# Altium schematic sheet SPWM_PS_V1.00.SCHDOC
size A3
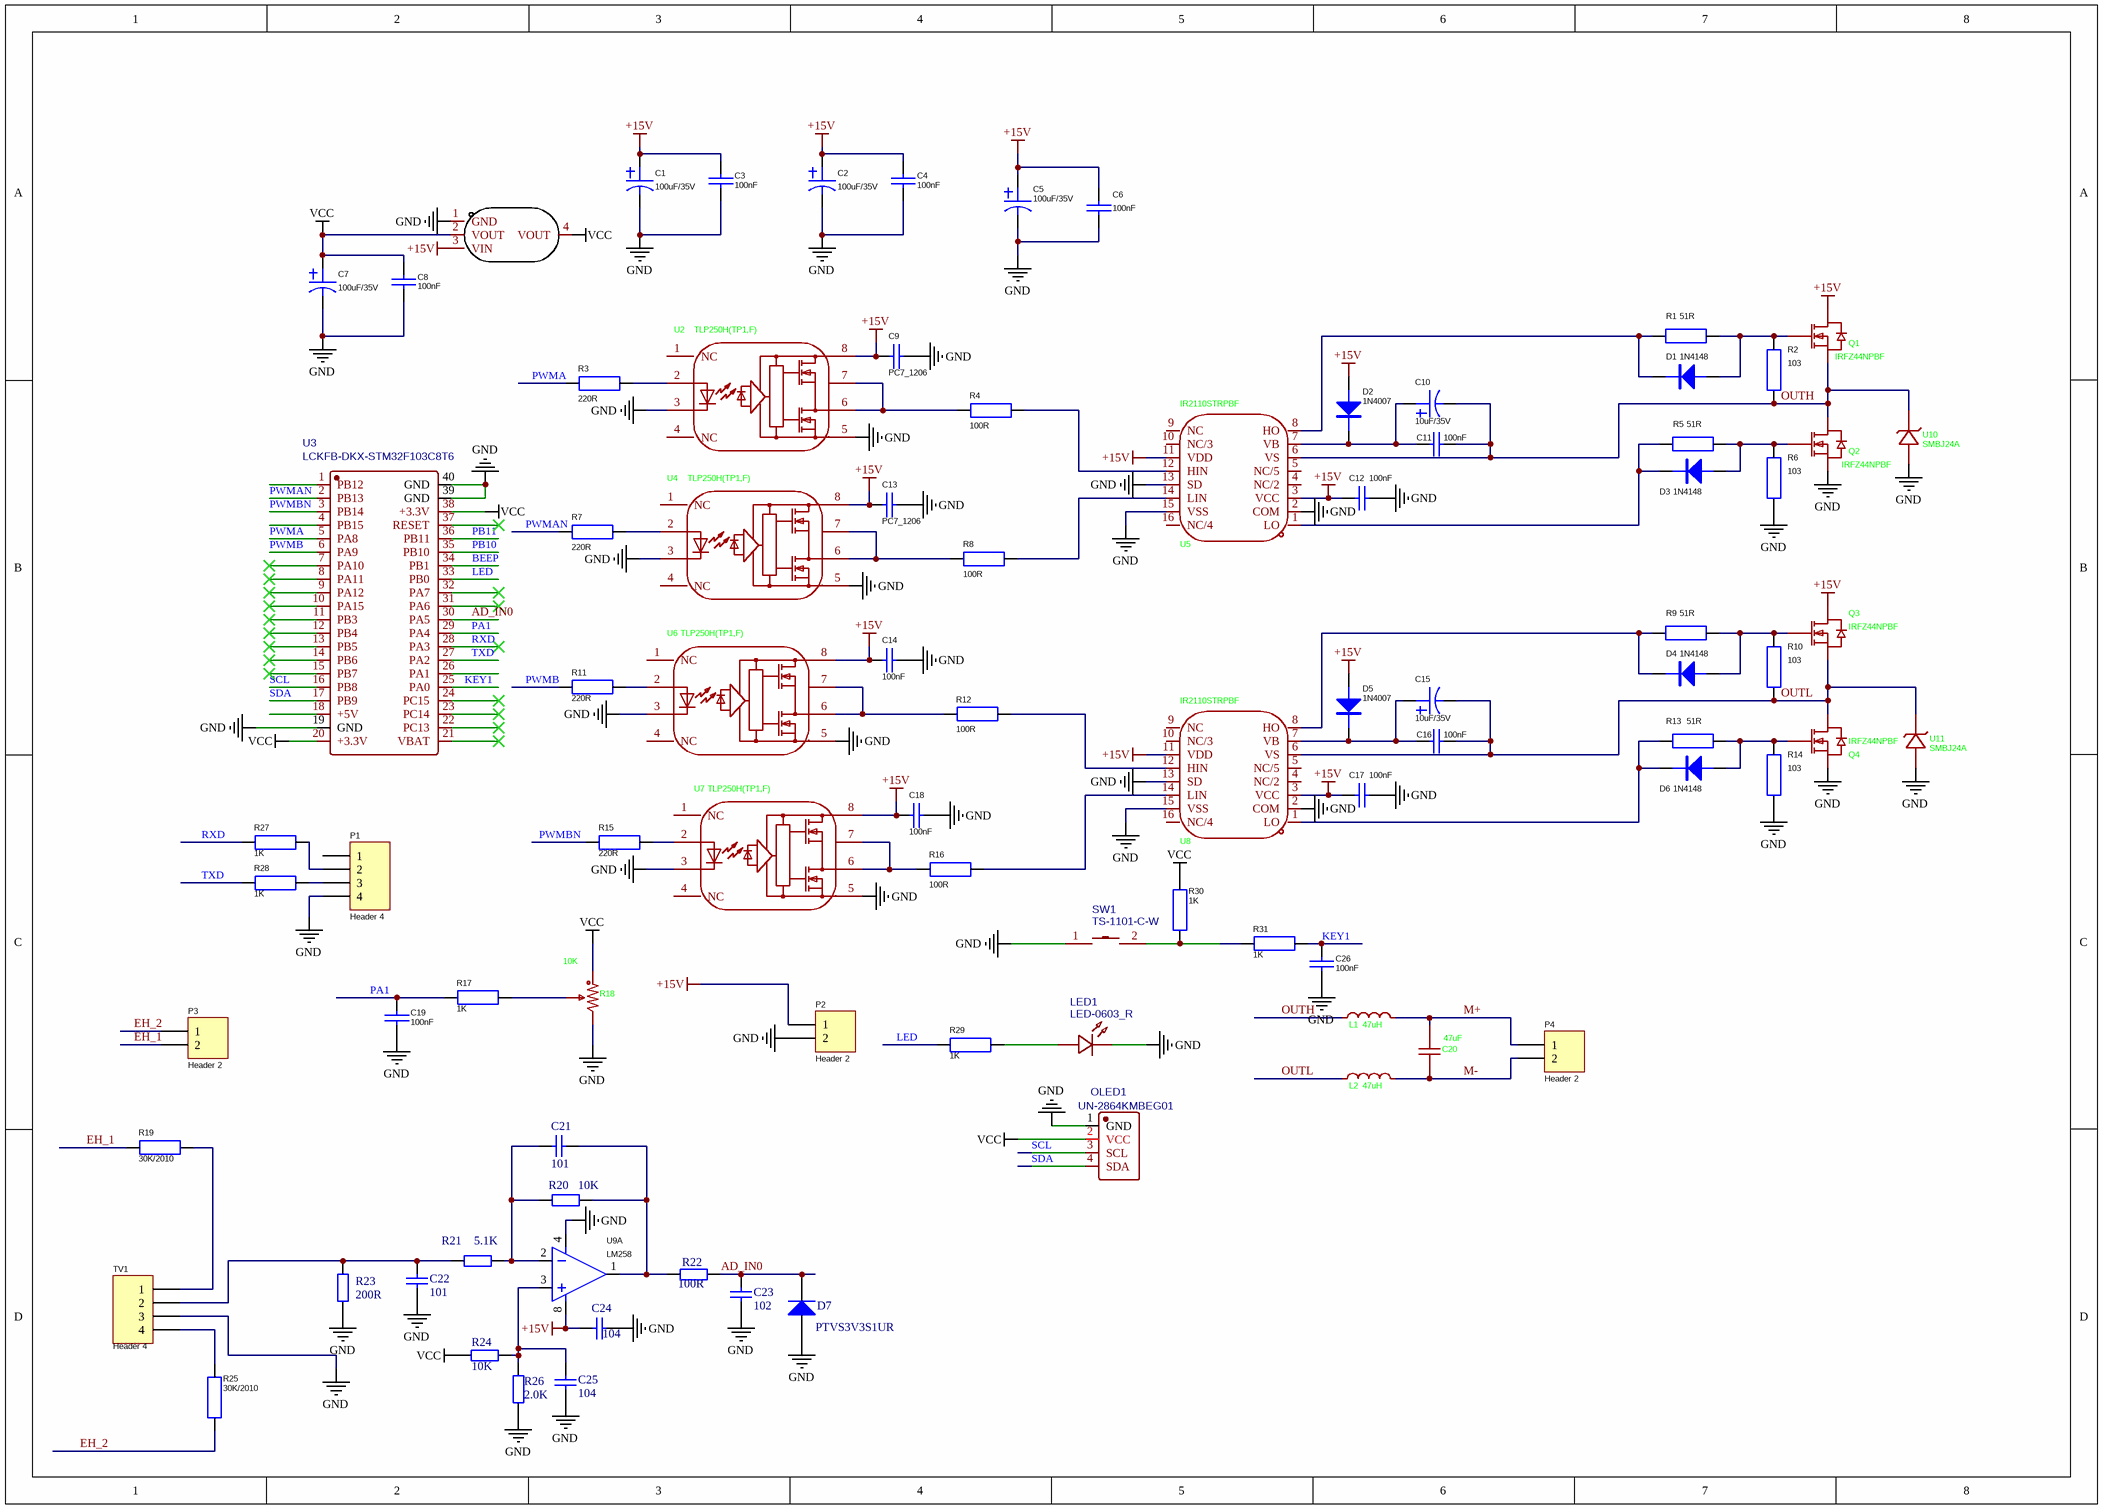
[diagram p0: SPWM_PS_V1.00.SCHDOC]

## Parts
C1  100uF/35V  [PCD-10135-MB-36_100UF/35V]
C2  100uF/35V  [PCD-10135-MB-36_100UF/35V]
C3  100nF  [PC7-*****-KN-0A_0805]
C4  100nF  [PC7-*****-KN-0A_0805]
C5  100uF/35V  [PCD-10135-MB-36_100UF/35V]
C6  100nF  [PC7-*****-KN-0A_0805]
C7  100uF/35V  [PCD-10135-MB-36_100UF/35V]
C8  100nF  [PC7-*****-KN-0A_0805]
C9  PC7_1206  [PC7-*****-KN-0A_0805]
C10  10uF/35V  [PCD-10050-MA-26_10UF/50V]
C11  100nF  [PC7-*****-KN-0A_0805]
C12  100nF  [PC7-*****-KN-0A_0805]
C13  PC7_1206  [PC7-*****-KN-0A_0805]
C14  100nF  [PC7-*****-KN-0A_0805]
C15  10uF/35V  [PCD-10050-MA-26_10UF/50V]
C16  100nF  [PC7-*****-KN-0A_0805]
C17  100nF  [PC7-*****-KN-0A_0805]
C18  100nF  [PC7-*****-KN-0A_0805]
C19  100nF  [PC7-*****-KN-0A_0805]
C20  47uF  [C2220]
C21  101  [PC7-*****-KN-0A_0805]
C22  101  [PC7-*****-KN-0A_0805]
C23  102  [PC7-*****-KN-0A_0805]
C24  104  [PC7-*****-KN-0A_0805]
C25  104  [PC7-*****-KN-0A_0805]
C26  100nF  [PC7-*****-KN-0A_0805]
D1  1N4148  [PDD-00020-30-2A_RLS4148NTE-11-K]
D2  1N4007  [PDD-00020-30-2A_RLS4148NTE-11-K]
D3  1N4148  [PDD-00020-30-2A_RLS4148NTE-11-K]
D4  1N4148  [PDD-00020-30-2A_RLS4148NTE-11-K]
D5  1N4007  [PDD-00020-30-2A_RLS4148NTE-11-K]
D6  1N4148  [PDD-00020-30-2A_RLS4148NTE-11-K]
D7  PTVS3V3S1UR  [SOD123]
L1  47uH  [IND-SMD_L13.8-W12.6_H6.5]
L2  47uH  [IND-SMD_L13.8-W12.6_H6.5]
LED1  LED-0603_R  [LED0603_RED]
OLED1  UN-2864KMBEG01  [OLED-TH_4P-P2.54-L27.8-W27.3]
P1  Header 4  [HDR1X4]
P2  Header 2  [CONN-TH_2P-P5.00_WJ128V-5.0-2P]
P3  Header 2  [CONN-TH_2P-P5.00_WJ128V-5.0-2P]
P4  Header 2  [CONN-TH_2P-P5.00_WJ128V-5.0-2P]
Q1  IRFZ44NPBF  [TO-220-3_L10.0-W4.5-P2.54-L]
Q2  IRFZ44NPBF  [TO-220-3_L10.0-W4.5-P2.54-L]
Q3  IRFZ44NPBF  [TO-220-3_L10.0-W4.5-P2.54-L]
Q4  IRFZ44NPBF  [TO-220-3_L10.0-W4.5-P2.54-L]
R1  51R  [PRC-*****-1M-0A_0805]
R2  103  [PRC-*****-1M-0A_0805]
R3  220R  [PRC-*****-1M-0A_0805]
R4  100R  [PRC-*****-1M-0A_0805]
R5  51R  [PRC-*****-1M-0A_0805]
R6  103  [PRC-*****-1M-0A_0805]
R7  220R  [PRC-*****-1M-0A_0805]
R8  100R  [PRC-*****-1M-0A_0805]
R9  51R  [PRC-*****-1M-0A_0805]
R10  103  [PRC-*****-1M-0A_0805]
R11  220R  [PRC-*****-1M-0A_0805]
R12  100R  [PRC-*****-1M-0A_0805]
R13  51R  [PRC-*****-1M-0A_0805]
R14  103  [PRC-*****-1M-0A_0805]
R15  220R  [PRC-*****-1M-0A_0805]
R16  100R  [PRC-*****-1M-0A_0805]
R17  1K  [PRC-*****-1M-0A_0805]
R18  10K  [RES-ADJ-TH_RK09Y11L0001]
R19  30K/2010  [PRC-*****-CM-0A_2010]
R20  10K  [PRM-*****-1N-0A_0805]
R21  5.1K  [PRM-*****-1N-0A_0805]
R22  100R  [PRM-*****-1N-0A_0805]
R23  200R  [PRM-*****-1N-0A_0805]
R24  10K  [PRM-*****-1N-0A_0805]
R25  30K/2010  [PRC-*****-CM-0A_2010]
R26  2.0K  [PRM-*****-1N-0A_0805]
R27  1K  [PRC-*****-1M-0A_0805]
R28  1K  [PRC-*****-1M-0A_0805]
R29  1K  [PRC-*****-1M-0A_0805]
R30  1K  [PRC-*****-1M-0A_0805]
R31  1K  [PRC-*****-1M-0A_0805]
SW1  TS-1101-C-W  [SW-SMD_L6.0-W3.3-LS8.0]
TV1  Header 4  [TV0815-1]
U1  AMS1117-3.3  [SOT-223-3_L6.5-W3.4-P2.30-LS7.0-BR]  (value not drawn)
U2  TLP250H(TP1,F)  [SMD-8_L9.6-W6.4-P2.54-LS9.6-BL]
U3  LCKFB-DKX-STM32F103C8T6  [CONN-TH_L53.3-W22.9_STM32F103C8T6-CARD]
U4  TLP250H(TP1,F)  [SMD-8_L9.6-W6.4-P2.54-LS9.6-BL]
U5  IR2110STRPBF  [SOIC-16_L10.3-W7.5-P1.27-LS10.3-BL]
U6  TLP250H(TP1,F)  [SMD-8_L9.6-W6.4-P2.54-LS9.6-BL]
U7  TLP250H(TP1,F)  [SMD-8_L9.6-W6.4-P2.54-LS9.6-BL]
U8  IR2110STRPBF  [SOIC-16_L10.3-W7.5-P1.27-LS10.3-BL]
U9  LM258  [LM358-SOIC-8]  (part A of 2)
U10  SMBJ24A  [SMB_L4.3-W3.6-LS5.3-RD]
U11  SMBJ24A  [SMB_L4.3-W3.6-LS5.3-RD]

## Nets
+15V: C1.1 C2.1 C3.1 C4.1 C5.1 C6.1 C9.1 C12.1 C13.1 C14.1 C17.1 C18.1 C24.1 D2.2 D5.2 P2.1 Q1.2(D) Q3.2(D) U1.3(VIN) U2.8(VCC) U4.8(VCC) U5.3(VCC) U5.11(VDD) U6.8(VCC) U7.8(VCC) U8.3(VCC) U8.11(VDD) U9.8
GND: C1.2 C2.2 C3.2 C4.2 C5.2 C6.2 C7.2 C8.2 C9.2 C12.2 C13.2 C14.2 C17.2 C18.2 C19.1 C22.1 C23.2 C24.2 C25.1 C26.1 D7.1(A) LED1.2 OLED1.1(GND) P1.4 P2.2 Q2.3(S) Q4.3(S) R6.1 R14.1 R18.3 R23.1 R26.2 SW1.1 TV1.3 U1.1(GND) U2.3(CAT) U2.5(GND) U3.19(GND) U3.39(GND) U3.40(GND) U4.3(CAT) U4.5(GND) U5.2(COM) U5.13(SD) U5.15(VSS) U6.3(CAT) U6.5(GND) U7.3(CAT) U7.5(GND) U8.2(COM) U8.13(SD) U8.15(VSS) U9.4 U10.2(A) U11.2(A)
VCC: C7.1 C8.1 OLED1.2(VCC) R18.1 R24.1 R30.2 U1.2(VOUT) U1.4(VOUT) U3.20(+3.3V) U3.38(+3.3V)
AD_IN0: C23.1 D7.2(K) R22.1 U3.30(PA5)
BEEP: U3.34(PB1)
EH_1: P3.2 R19.2
EH_2: P3.1 R25.1
KEY1: C26.2 R31.2 U3.25(PA0)
LED: R29.1 U3.33(PB0)
M+: C20.2 L1.2 P4.1
M-: C20.1 L2.2 P4.2
OUTH: C10.2 C11.2 L1.1 Q1.3(S) Q2.2(D) R2.1 U5.6(VS) U10.1(C)
OUTL: C15.2 C16.2 L2.1 Q3.3(S) Q4.2(D) R10.1 U8.6(VS) U11.1(C)
PA1: C19.2 R17.1 U3.29(PA4)
PB10: U3.35(PB10)
PB11: U3.36(PB11)
PWMA: R3.1 U3.5(PA8)
PWMAN: R7.1 U3.2(PB13)
PWMB: R11.1 U3.6(PA9)
PWMBN: R15.1 U3.3(PB14)
RXD: R27.1 U3.28(PA3)
SCL: OLED1.3(SCL) U3.16(PB8)
SDA: OLED1.4(SDA) U3.17(PB9)
TXD: R28.1 U3.27(PA2)
NetC10_1: C10.1 C11.1 D2.1 U5.7(VB)
NetC15_1: C15.1 C16.1 D5.1 U8.7(VB)
NetC21_1: C21.1 R20.1 R22.2 U9.1
NetC21_2: C21.2 R20.2 R21.1 U9.2
NetC22_2: C22.2 R21.2 R23.2 TV1.2
NetC25_2: C25.2 R24.2 R26.1 U9.3
NetD1_1: D1.1 R1.1 U5.8(HO)
NetD1_2: D1.2 Q1.1(G) R1.2 R2.2
NetD3_1: D3.1 R5.1 U5.1(LO)
NetD3_2: D3.2 Q2.1(G) R5.2 R6.2
NetD4_1: D4.1 R9.1 U8.8(HO)
NetD4_2: D4.2 Q3.1(G) R9.2 R10.2
NetD6_1: D6.1 R13.1 U8.1(LO)
NetD6_2: D6.2 Q4.1(G) R13.2 R14.2
NetLED1_1: LED1.1 R29.2
NetP1_2: P1.2 R27.2
NetP1_3: P1.3 R28.2
NetR3_2: R3.2 U2.2(AN)
NetR4_1: R4.1 U2.6(VO) U2.7(NC)
NetR4_2: R4.2 U5.12(HIN)
NetR7_2: R7.2 U4.2(AN)
NetR8_1: R8.1 U4.6(VO) U4.7(NC)
NetR8_2: R8.2 U5.14(LIN)
NetR11_2: R11.2 U6.2(AN)
NetR12_1: R12.1 U6.6(VO) U6.7(NC)
NetR12_2: R12.2 U8.12(HIN)
NetR15_2: R15.2 U7.2(AN)
NetR16_1: R16.1 U7.6(VO) U7.7(NC)
NetR16_2: R16.2 U8.14(LIN)
NetR17_2: R17.2 R18.2
NetR19_1: R19.1 TV1.1
NetR25_2: R25.2 TV1.4
NetR30_1: R30.1 R31.1 SW1.2

Not connected (* = marked no-connect by the designer): P1 1; U2 1(NC) 4(NC); U3 1(PB12) 4(PB15) 7(PA10)* 8(PA11)* 9(PA12)* 10(PA15)* 11(PB3)* 12(PB4)* 13(PB5)* 14(PB6)* 15(PB7)* 18(+5V) 21(VBAT)* 22(PC13)* 23(PC14)* 24(PC15)* 26(PA1) 31(PA6)* 32(PA7)* 37(RESET)*; U4 1(NC) 4(NC); U5 4(NC/2) 5(NC/5) 9(NC) 10(NC/3) 16(NC/4); U6 1(NC) 4(NC); U7 1(NC) 4(NC); U8 4(NC/2) 5(NC/5) 9(NC) 10(NC/3) 16(NC/4)

## Library data of the parts
C1 C2 C5 C7 C10 C15 = PCD_100uF/35V: PCD-10135-MB-36
C3 C4 C6 C8 C9 C11-C14 C16-C19 C26 = PC7_1206: PC7-*****-KM-0A_1206
C20 = FS55X226K101LRG: Symbol: FE2HX476M500LGL; Add into BOM: yes; Value: 22uF; Voltage Rating: 100V; Temperature Coefficient: X7R; Device: FE2HX476M500LGL; Supplier Part: C5447693; Manufacturer Part: FS55X226K101LRG; Supplier Footprint: 2220; JLCPCB Part Class: Extended Part; Datasheet: https://atta.szlcsc.com/upload/public/pdf/source/20190723/C381466_B1CCDB289216E7EE775C98769E222CFD.pdf; Supplier: LCSC; Convert to PCB: yes
C21-C25 = Cap Semi: Capacitor (Semiconductor SIM Model); Value: 103; Published: 8-Jun-2000; LatestRevisionDate: 17-Jul-2002; LatestRevisionNote: Re-released for DXP Platform.; PackageReference: C1206; Publisher: Altium Limited
D1-D6 = PDD_RLS4148NTE-11-K: PDD-00020-30-2A
D7 = Diode: Default Diode; Published: 8-Jun-2000; LatestRevisionDate: 17-Jul-2002; LatestRevisionNote: Re-released for DXP Platform.; PackageDocument: Sep-1996; PackageReference: SMC; Publisher: Altium Limited; Code_JEDEC: DO-214-AB
L1 L2 = YSPI1365-470M: Add into BOM: yes; Current Rating: 5A; Symbol: YSPI1365-470M; Device: YSPI1365-470M; Supplier Part: C497913; Manufacturer Part: YSPI1365-470M; Supplier Footprint: SMD,13.8x12.6x6.5mm; JLCPCB Part Class: Extended Part; Datasheet: https://atta.szlcsc.com/upload/public/pdf/source/20230801/AED9D02F50D39DFEE57BC1CE3E1D3DA7.pdf; Supplier: LCSC; Convert to PCB: yes; Value: 47uH
LED1 = LED-0603_R: Manufacturer Part: 19-217/R6C-AL1M2VY/3T; Contributor: LCEDA_01; Supplier Part: C72044; Supplier: LCSC; spicePre: L; spiceSymbolName: LED-0603_R
OLED1 = UN-2864KMBEG01: Manufacturer: null; Contributor: lcsc; Supplier: LCSC; Supplier Part: C9900067968; Manufacturer Part: UN-2864KMBEG01; link: https://so.szlcsc.com/global.html?k=C9900067968&ref=editor; spicePre: O; spiceSymbolName: UN-2864KMBEG01
P1 TV1 = Header 4: Header, 4-Pin; LatestRevisionDate: 17-Jul-2002; LatestRevisionNote: Re-released for DXP Platform.; Publisher: Altium Limited
P2-P4 = Header 2: Header, 2-Pin; LatestRevisionDate: 17-Jul-2002; LatestRevisionNote: Re-released for DXP Platform.; Publisher: Altium Limited
Q1-Q4 = IRFZ44NPBF: Add into BOM: yes; Drain Source Voltage (Vdss): 55V; Continuous Drain Current (Id): 49A; Power Dissipation (Pd): 94W; Gate Threshold Voltage (Vgs(th)@Id): 4V@250uA; Total Gate Charge (Qg@Vgs): 63nC; Input Capacitance (Ciss@Vds): 1.47nF; Reverse Transfer Capacitance (Crss@Vds): 88pF; Symbol: IRFZ44NPBF; Device: IRFZ44NPBF; Supplier Part: C2586; Manufacturer Part: IRFZ44NPBF; Supplier Footprint: TO-220-3; JLCPCB Part Class: Extended Part; Datasheet: https://atta.szlcsc.com/upload/public/pdf/source/20120403/1457706463862.pdf; Supplier: LCSC; Convert to PCB: yes
R1-R17 R27-R31 = PRC_1206: PRC-*****-2M-0A_1206; Text Field1: pristel=\Models.lib
R18 = RK09Y11L0001: Add into BOM: yes; Rated Voltage: 5V; Power(Watts): 10mW; Symbol: RK09Y11L0001; Device: RK09Y11L0001; Supplier Part: C470717; Manufacturer Part: RK09Y11L0001; JLCPCB Part Class: Extended Part; Datasheet: https://atta.szlcsc.com/upload/public/pdf/source/20191216/C470717_16CAC093C2E66951156909DBA984502E.pdf; Supplier: LCSC; Convert to PCB: yes; Turns: -
R19 R25 = PRC_2010: PRC-*****-CM-0A_2010; Text Field1: pristel=\Models.lib
R20-R22 R24 R26 = RES-SM
R23 = RES-SM: R: 100K
SW1 = TS-1101-C-W: Contributor: LCSC; Supplier: LCSC; Supplier Part: C318938; Manufacturer Part: TS-1101-C-W; JLCPCB Part Class: Extended Part; link: https://so.szlcsc.com/global.html?k=C318938&ref=editor; spicePre: S; spiceSymbolName: TS-1101-C-W
U1 = AMS1117-3.3_C6186: Manufacturer: AMS; Add into BOM: yes; Output Voltage: 3.3V; MAX Output Current: 1A; Power Supply Rejection Ratio (PSRR): 72dB@(120Hz); Dropout Voltage: 1.3V@(800mA); Number of Outputs: 1; Symbol: AMS1117-3.3; Device: AMS1117-3.3_C6186; Supplier Part: C6186; Manufacturer Part: AMS1117-3.3; Supplier Footprint: SOT-223; JLCPCB Part Class: Basic Part; Datasheet: https://atta.szlcsc.com/upload/public/pdf/source/20180727/C6186_7A095716F0823C02F1997A905E26C086.pdf; Supplier: LCSC; Convert to PCB: yes; Maximum Input Voltage: -; standby current: -; Noise: -; Feature: -; Operating Temperature: -; Comment_1: AMS1117-3.3
U2 U4 U6 U7 = TLP250H(TP1,F): Add into BOM: yes; Input Type: DC; Supply Voltage: 10V~30V; Isolation Voltage(rms): 3.75kV; Common Mode Transient Immunity (CMTI): 40kV/us; Number of Channels: 1; Symbol: TLP250H(TP1,F); Device: TLP250H(TP1,F); Supplier Part: C3002258; Manufacturer Part: TLP250H(TP1,F); Supplier Footprint: SOP-8-2.54mm; JLCPCB Part Class: Extended Part; Datasheet: https://atta.szlcsc.com/upload/public/pdf/source/20161130/1480498800441.pdf; Supplier: LCSC; Convert to PCB: yes
U3 = LCKFB-DKX-STM32F103C8T6: Contributor: lcsc; Supplier: LCSC; Supplier Part: C22396880; Manufacturer Part: LCKFB-DKX-STM32F103C8T6; JLCPCB Part Class: Extended Part; link: https://so.szlcsc.com/global.html?k=C22396880&ref=editor; spicePre: U; spiceSymbolName: LCKFB-DKX-STM32F103C8T6
U5 U8 = IR2110STRPBF: Add into BOM: yes; Number of Drivers: 2; Peak Output Current(sink): 2A; Supply Voltage: 3.3V~20V; Rise Time: 25ns; Fall Time: 17ns; Symbol: IR2110STRPBF; Device: IR2110STRPBF; LCSC Part Name: IR2110STRPBF; Supplier Part: C2968; Manufacturer Part: IR2110STRPBF; Supplier Footprint: SOIC-16-300mil; JLCPCB Part Class: Extended Part; Datasheet: https://atta.szlcsc.com/upload/public/pdf/source/20190222/C371542_1B779ED12CDCFC0BFEA8323EC05804C9.pdf; Supplier: LCSC; Convert to PCB: yes; Peak Output Current(source): 2A
U9 = PIC_NJM2904: PIC-01330-01-20
U10 U11 = SMBJ24A_C19077578: Add into BOM: yes; Reverse Stand-Off Voltage (Vrwm): 24V; Clamping Voltage: 38.9V; Peak Pulse Current (Ipp): 15.42A; Peak Pulse Power Dissipation (Ppp): 600W; Voltage - Breakdown: 29.5V; Reverse Leakage Current (Ir): 5uA; Symbol: SMBJ24A_C19077578; Device: SMBJ24A_C19077578; LCSC Part Name: SMBJ24A; Supplier Part: C19077578; Manufacturer Part: SMBJ24A; Supplier Footprint: SMB; JLCPCB Part Class: Extended Part; Datasheet: https://atta.szlcsc.com/upload/public/pdf/source/20250107/474F05451FC8AB27D7FA0238914F96F6.pdf; Supplier: LCSC; Convert to PCB: yes; Operating Temperature: -; Type: TVS